# EAGLE schematic Thermal Cycler Calibration Plate v1 (EAGLE 7.5.0)
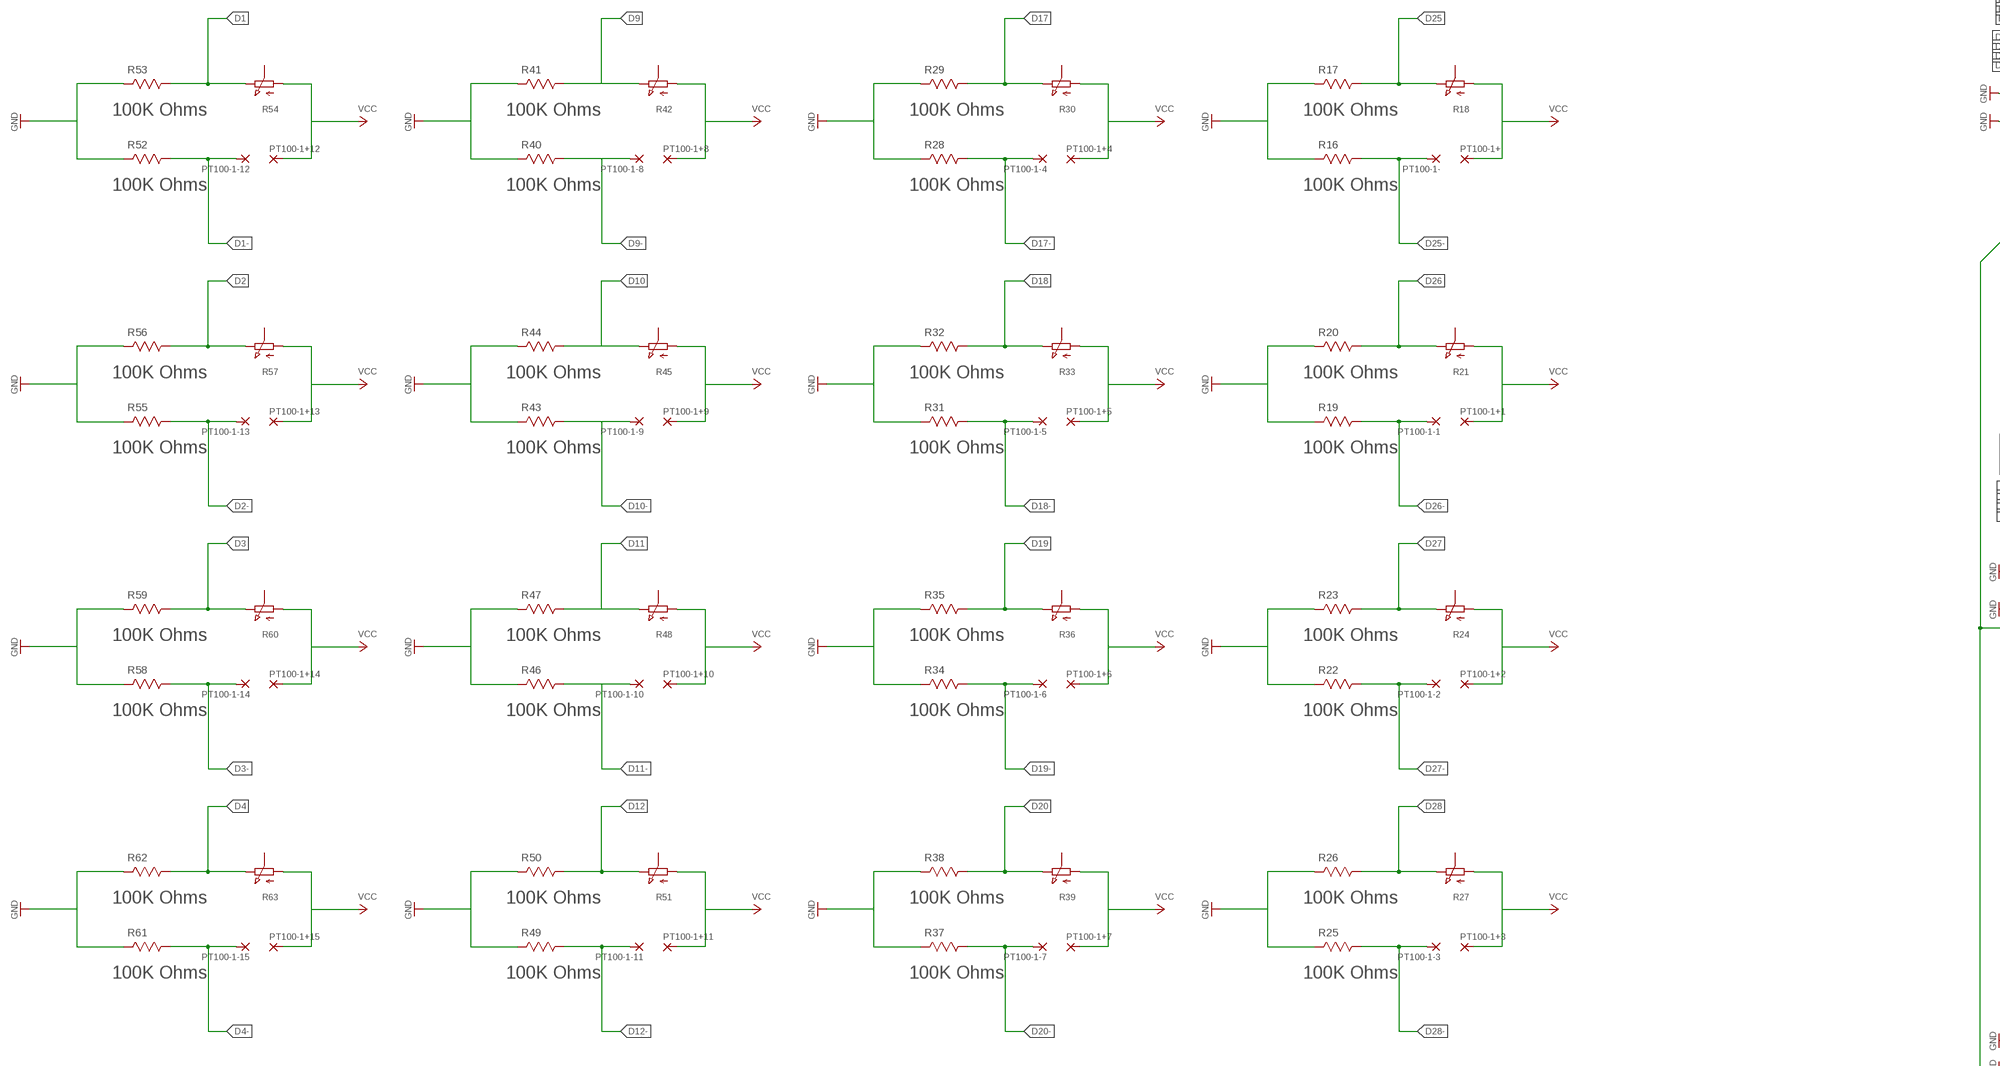
[diagram p0: schematic, sheet 1, part 1 of 3]
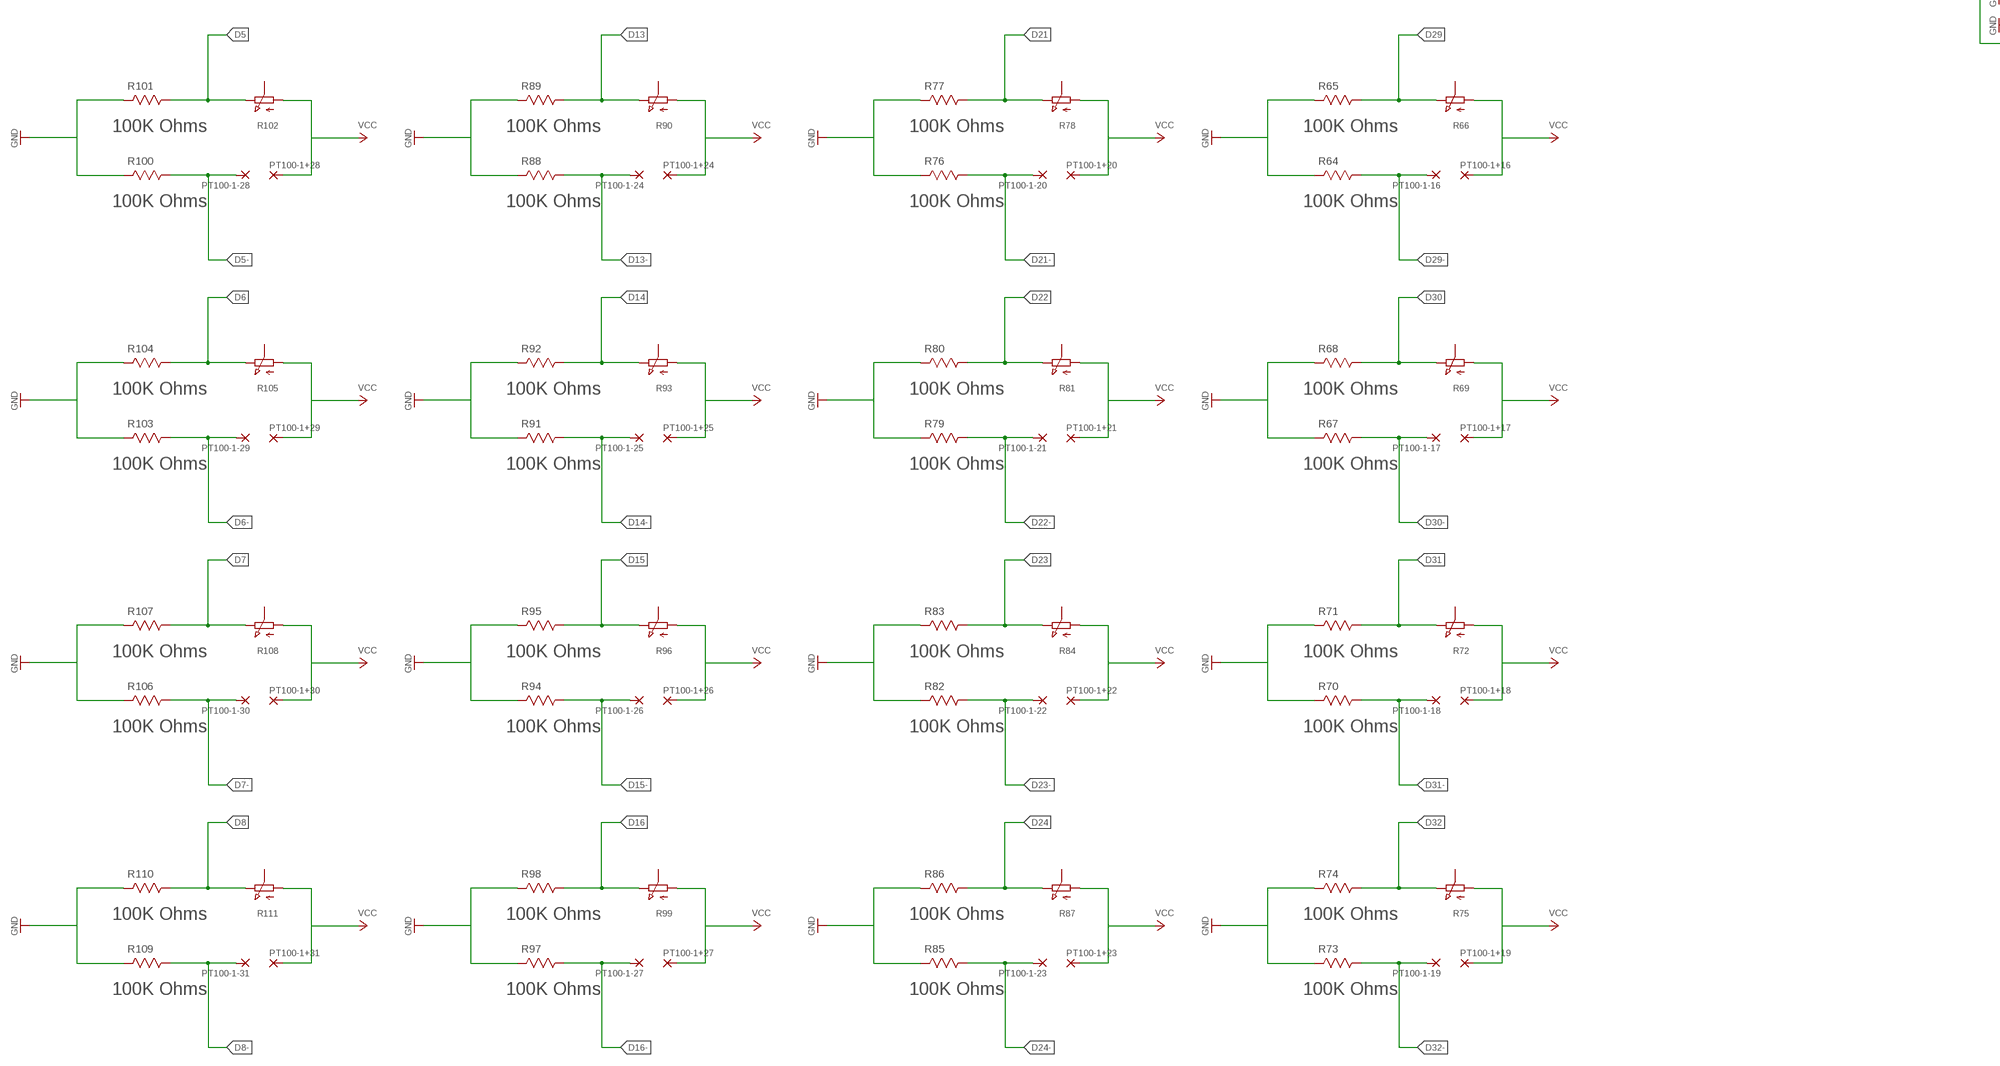
[diagram p1: schematic, sheet 1, part 2 of 3]
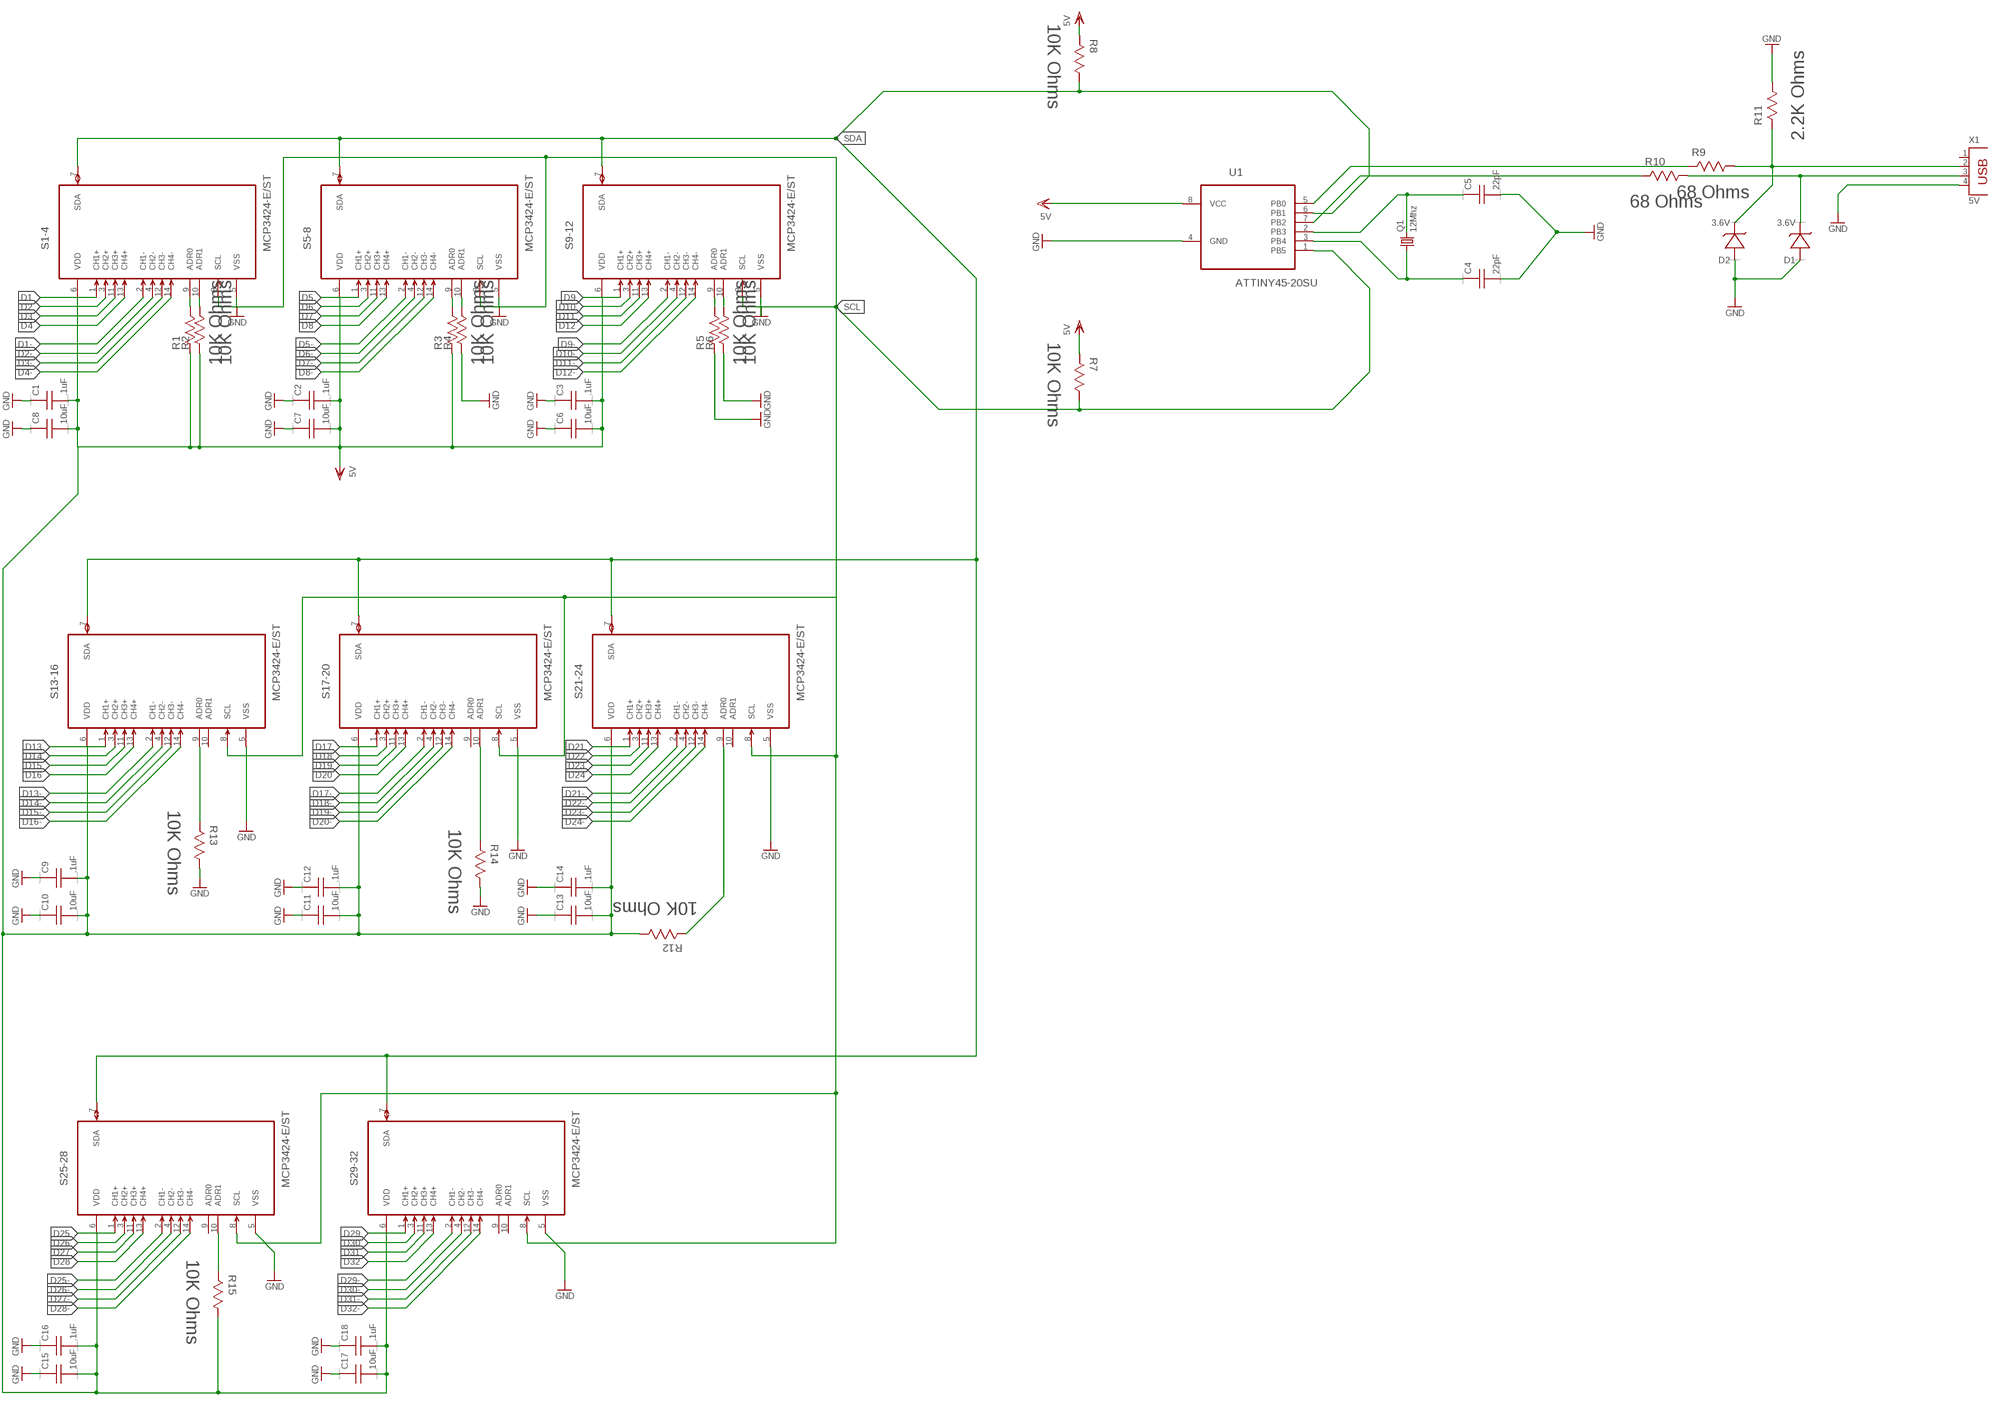
[diagram p2: schematic, sheet 1, part 3 of 3]

## Parts
C1  .1uF  CAP  [C0805]
C2  .1uF  CAP  [C0805]
C3  .1uF  CAP  [C0805]
C4  22pF  CAP  [C0805]
C5  22pF  CAP  [C0805]
C6  10uF  CAP  [C0805]
C7  10uF  CAP  [C0805]
C8  10uF  CAP  [C0805]
C9  .1uF  CAP  [C0805]
C10  10uF  CAP  [C0805]
C11  10uF  CAP  [C0805]
C12  .1uF  CAP  [C0805]
C13  10uF  CAP  [C0805]
C14  .1uF  CAP  [C0805]
C15  10uF  CAP  [C0805]
C16  .1uF  CAP  [C0805]
C17  10uF  CAP  [C0805]
C18  .1uF  CAP  [C0805]
D1  3.6V  ZENER  [SOD123]
D2  3.6V  ZENER  [SOD123]
PT100-1+  1,6/0,8  [1,6/0,8]
PT100-1+1  1,6/0,8  [1,6/0,8]
PT100-1+2  1,6/0,8  [1,6/0,8]
PT100-1+3  1,6/0,8  [1,6/0,8]
PT100-1+4  1,6/0,8  [1,6/0,8]
PT100-1+5  1,6/0,8  [1,6/0,8]
PT100-1+6  1,6/0,8  [1,6/0,8]
PT100-1+7  1,6/0,8  [1,6/0,8]
PT100-1+8  1,6/0,8  [1,6/0,8]
PT100-1+9  1,6/0,8  [1,6/0,8]
PT100-1+10  1,6/0,8  [1,6/0,8]
PT100-1+11  1,6/0,8  [1,6/0,8]
PT100-1+12  1,6/0,8  [1,6/0,8]
PT100-1+13  1,6/0,8  [1,6/0,8]
PT100-1+14  1,6/0,8  [1,6/0,8]
PT100-1+15  1,6/0,8  [1,6/0,8]
PT100-1+16  1,6/0,8  [1,6/0,8]
PT100-1+17  1,6/0,8  [1,6/0,8]
PT100-1+18  1,6/0,8  [1,6/0,8]
PT100-1+19  1,6/0,8  [1,6/0,8]
PT100-1+20  1,6/0,8  [1,6/0,8]
PT100-1+21  1,6/0,8  [1,6/0,8]
PT100-1+22  1,6/0,8  [1,6/0,8]
PT100-1+23  1,6/0,8  [1,6/0,8]
PT100-1+24  1,6/0,8  [1,6/0,8]
PT100-1+25  1,6/0,8  [1,6/0,8]
PT100-1+26  1,6/0,8  [1,6/0,8]
PT100-1+27  1,6/0,8  [1,6/0,8]
PT100-1+28  1,6/0,8  [1,6/0,8]
PT100-1+29  1,6/0,8  [1,6/0,8]
PT100-1+30  1,6/0,8  [1,6/0,8]
PT100-1+31  1,6/0,8  [1,6/0,8]
PT100-1-  1,6/0,8  [1,6/0,8]
PT100-1-1  1,6/0,8  [1,6/0,8]
PT100-1-2  1,6/0,8  [1,6/0,8]
PT100-1-3  1,6/0,8  [1,6/0,8]
PT100-1-4  1,6/0,8  [1,6/0,8]
PT100-1-5  1,6/0,8  [1,6/0,8]
PT100-1-6  1,6/0,8  [1,6/0,8]
PT100-1-7  1,6/0,8  [1,6/0,8]
PT100-1-8  1,6/0,8  [1,6/0,8]
PT100-1-9  1,6/0,8  [1,6/0,8]
PT100-1-10  1,6/0,8  [1,6/0,8]
PT100-1-11  1,6/0,8  [1,6/0,8]
PT100-1-12  1,6/0,8  [1,6/0,8]
PT100-1-13  1,6/0,8  [1,6/0,8]
PT100-1-14  1,6/0,8  [1,6/0,8]
PT100-1-15  1,6/0,8  [1,6/0,8]
PT100-1-16  1,6/0,8  [1,6/0,8]
PT100-1-17  1,6/0,8  [1,6/0,8]
PT100-1-18  1,6/0,8  [1,6/0,8]
PT100-1-19  1,6/0,8  [1,6/0,8]
PT100-1-20  1,6/0,8  [1,6/0,8]
PT100-1-21  1,6/0,8  [1,6/0,8]
PT100-1-22  1,6/0,8  [1,6/0,8]
PT100-1-23  1,6/0,8  [1,6/0,8]
PT100-1-24  1,6/0,8  [1,6/0,8]
PT100-1-25  1,6/0,8  [1,6/0,8]
PT100-1-26  1,6/0,8  [1,6/0,8]
PT100-1-27  1,6/0,8  [1,6/0,8]
PT100-1-28  1,6/0,8  [1,6/0,8]
PT100-1-29  1,6/0,8  [1,6/0,8]
PT100-1-30  1,6/0,8  [1,6/0,8]
PT100-1-31  1,6/0,8  [1,6/0,8]
Q1  12Mhz  CRYSTALHC49UP  [HC49UP]
R1  10K Ohms  P0805Z1002WNT0079  [RESC2013X65N]
R2  10K Ohms  P0805Z1002WNT0079  [RESC2013X65N]
R3  10K Ohms  P0805Z1002WNT0079  [RESC2013X65N]
R4  10K Ohms  P0805Z1002WNT0079  [RESC2013X65N]
R5  10K Ohms  P0805Z1002WNT0079  [RESC2013X65N]
R6  10K Ohms  P0805Z1002WNT0079  [RESC2013X65N]
R7  10K Ohms  P0805Z1002WNT0079  [RESC2013X65N]
R8  10K Ohms  P0805Z1002WNT0079  [RESC2013X65N]
R9  68 Ohms  P0805Z1002WNT0079  [RESC2013X65N]
R10  68 Ohms  P0805Z1002WNT0079  [RESC2013X65N]
R11  2.2K Ohms  P0805Z1002WNT0079  [RESC2013X65N]
R12  10K Ohms  P0805Z1002WNT0079  [RESC2013X65N]
R13  10K Ohms  P0805Z1002WNT0079  [RESC2013X65N]
R14  10K Ohms  P0805Z1002WNT0079  [RESC2013X65N]
R15  10K Ohms  P0805Z1002WNT0079  [RESC2013X65N]
R16  100K Ohms  TNPW0805100KBEEN  [RESC2013X65N]
R17  100K Ohms  TNPW0805100KBEEN  [RESC2013X65N]
R18  PC25  [PC25]
R19  100K Ohms  TNPW0805100KBEEN  [RESC2013X65N]
R20  100K Ohms  TNPW0805100KBEEN  [RESC2013X65N]
R21  PC25  [PC25]
R22  100K Ohms  TNPW0805100KBEEN  [RESC2013X65N]
R23  100K Ohms  TNPW0805100KBEEN  [RESC2013X65N]
R24  PC25  [PC25]
R25  100K Ohms  TNPW0805100KBEEN  [RESC2013X65N]
R26  100K Ohms  TNPW0805100KBEEN  [RESC2013X65N]
R27  PC25  [PC25]
R28  100K Ohms  TNPW0805100KBEEN  [RESC2013X65N]
R29  100K Ohms  TNPW0805100KBEEN  [RESC2013X65N]
R30  PC25  [PC25]
R31  100K Ohms  TNPW0805100KBEEN  [RESC2013X65N]
R32  100K Ohms  TNPW0805100KBEEN  [RESC2013X65N]
R33  PC25  [PC25]
R34  100K Ohms  TNPW0805100KBEEN  [RESC2013X65N]
R35  100K Ohms  TNPW0805100KBEEN  [RESC2013X65N]
R36  PC25  [PC25]
R37  100K Ohms  TNPW0805100KBEEN  [RESC2013X65N]
R38  100K Ohms  TNPW0805100KBEEN  [RESC2013X65N]
R39  PC25  [PC25]
R40  100K Ohms  TNPW0805100KBEEN  [RESC2013X65N]
R41  100K Ohms  TNPW0805100KBEEN  [RESC2013X65N]
R42  PC25  [PC25]
R43  100K Ohms  TNPW0805100KBEEN  [RESC2013X65N]
R44  100K Ohms  TNPW0805100KBEEN  [RESC2013X65N]
R45  PC25  [PC25]
R46  100K Ohms  TNPW0805100KBEEN  [RESC2013X65N]
R47  100K Ohms  TNPW0805100KBEEN  [RESC2013X65N]
R48  PC25  [PC25]
R49  100K Ohms  TNPW0805100KBEEN  [RESC2013X65N]
R50  100K Ohms  TNPW0805100KBEEN  [RESC2013X65N]
R51  PC25  [PC25]
R52  100K Ohms  TNPW0805100KBEEN  [RESC2013X65N]
R53  100K Ohms  TNPW0805100KBEEN  [RESC2013X65N]
R54  PC25  [PC25]
R55  100K Ohms  TNPW0805100KBEEN  [RESC2013X65N]
R56  100K Ohms  TNPW0805100KBEEN  [RESC2013X65N]
R57  PC25  [PC25]
R58  100K Ohms  TNPW0805100KBEEN  [RESC2013X65N]
R59  100K Ohms  TNPW0805100KBEEN  [RESC2013X65N]
R60  PC25  [PC25]
R61  100K Ohms  TNPW0805100KBEEN  [RESC2013X65N]
R62  100K Ohms  TNPW0805100KBEEN  [RESC2013X65N]
R63  PC25  [PC25]
R64  100K Ohms  TNPW0805100KBEEN  [RESC2013X65N]
R65  100K Ohms  TNPW0805100KBEEN  [RESC2013X65N]
R66  PC25  [PC25]
R67  100K Ohms  TNPW0805100KBEEN  [RESC2013X65N]
R68  100K Ohms  TNPW0805100KBEEN  [RESC2013X65N]
R69  PC25  [PC25]
R70  100K Ohms  TNPW0805100KBEEN  [RESC2013X65N]
R71  100K Ohms  TNPW0805100KBEEN  [RESC2013X65N]
R72  PC25  [PC25]
R73  100K Ohms  TNPW0805100KBEEN  [RESC2013X65N]
R74  100K Ohms  TNPW0805100KBEEN  [RESC2013X65N]
R75  PC25  [PC25]
R76  100K Ohms  TNPW0805100KBEEN  [RESC2013X65N]
R77  100K Ohms  TNPW0805100KBEEN  [RESC2013X65N]
R78  PC25  [PC25]
R79  100K Ohms  TNPW0805100KBEEN  [RESC2013X65N]
R80  100K Ohms  TNPW0805100KBEEN  [RESC2013X65N]
R81  PC25  [PC25]
R82  100K Ohms  TNPW0805100KBEEN  [RESC2013X65N]
R83  100K Ohms  TNPW0805100KBEEN  [RESC2013X65N]
R84  PC25  [PC25]
R85  100K Ohms  TNPW0805100KBEEN  [RESC2013X65N]
R86  100K Ohms  TNPW0805100KBEEN  [RESC2013X65N]
R87  PC25  [PC25]
R88  100K Ohms  TNPW0805100KBEEN  [RESC2013X65N]
R89  100K Ohms  TNPW0805100KBEEN  [RESC2013X65N]
R90  PC25  [PC25]
R91  100K Ohms  TNPW0805100KBEEN  [RESC2013X65N]
R92  100K Ohms  TNPW0805100KBEEN  [RESC2013X65N]
R93  PC25  [PC25]
R94  100K Ohms  TNPW0805100KBEEN  [RESC2013X65N]
R95  100K Ohms  TNPW0805100KBEEN  [RESC2013X65N]
R96  PC25  [PC25]
R97  100K Ohms  TNPW0805100KBEEN  [RESC2013X65N]
R98  100K Ohms  TNPW0805100KBEEN  [RESC2013X65N]
R99  PC25  [PC25]
R100  100K Ohms  TNPW0805100KBEEN  [RESC2013X65N]
R101  100K Ohms  TNPW0805100KBEEN  [RESC2013X65N]
R102  PC25  [PC25]
R103  100K Ohms  TNPW0805100KBEEN  [RESC2013X65N]
R104  100K Ohms  TNPW0805100KBEEN  [RESC2013X65N]
R105  PC25  [PC25]
R106  100K Ohms  TNPW0805100KBEEN  [RESC2013X65N]
R107  100K Ohms  TNPW0805100KBEEN  [RESC2013X65N]
R108  PC25  [PC25]
R109  100K Ohms  TNPW0805100KBEEN  [RESC2013X65N]
R110  100K Ohms  TNPW0805100KBEEN  [RESC2013X65N]
R111  PC25  [PC25]
S1-4  MCP3424-E/ST  [SOP65P640X120-14N]
S5-8  MCP3424-E/ST  [SOP65P640X120-14N]
S9-12  MCP3424-E/ST  [SOP65P640X120-14N]
S13-16  MCP3424-E/ST  [SOP65P640X120-14N]
S17-20  MCP3424-E/ST  [SOP65P640X120-14N]
S21-24  MCP3424-E/ST  [SOP65P640X120-14N]
S25-28  MCP3424-E/ST  [SOP65P640X120-14N]
S29-32  MCP3424-E/ST  [SOP65P640X120-14N]
U1  ATTINY45-20SU  [SOIC127P798X216-8N]
X1  5V  PN87520  [PN87520]

## Nets
D1: R53.1 R54.E S1-4.1(CH1+)
D1-: PT100-1-12.1(P) R52.1 S1-4.2(CH1-)
D2: R56.1 R57.E S1-4.3(CH2+)
D2-: PT100-1-13.1(P) R55.1 S1-4.4(CH2-)
D3: R59.1 R60.E S1-4.11(CH3+)
D3-: PT100-1-14.1(P) R58.1 S1-4.12(CH3-)
D4: R62.1 R63.E S1-4.13(CH4+)
D4-: PT100-1-15.1(P) R61.1 S1-4.14(CH4-)
D5: R101.1 R102.E S5-8.1(CH1+)
D5-: PT100-1-28.1(P) R100.1 S5-8.2(CH1-)
D6: R104.1 R105.E S5-8.3(CH2+)
D6-: PT100-1-29.1(P) R103.1 S5-8.4(CH2-)
D7: R107.1 R108.E S5-8.11(CH3+)
D7-: PT100-1-30.1(P) R106.1 S5-8.12(CH3-)
D8: R110.1 R111.E S5-8.13(CH4+)
D8-: PT100-1-31.1(P) R109.1 S5-8.14(CH4-)
D9: R41.1 R42.E S9-12.1(CH1+)
D9-: PT100-1-8.1(P) R40.1 S9-12.2(CH1-)
D10: R44.1 R45.E S9-12.3(CH2+)
D10-: PT100-1-9.1(P) R43.1 S9-12.4(CH2-)
D11: R47.1 R48.E S9-12.11(CH3+)
D11-: PT100-1-10.1(P) R46.1 S9-12.12(CH3-)
D12: R50.1 R51.E S9-12.13(CH4+)
D12-: PT100-1-11.1(P) R49.1 S9-12.14(CH4-)
D13: R89.1 R90.E S13-16.1(CH1+)
D13-: PT100-1-24.1(P) R88.1 S13-16.2(CH1-)
D14: R92.1 R93.E S13-16.3(CH2+)
D14-: PT100-1-25.1(P) R91.1 S13-16.4(CH2-)
D15: R95.1 R96.E S13-16.11(CH3+)
D15-: PT100-1-26.1(P) R94.1 S13-16.12(CH3-)
D16: R98.1 R99.E S13-16.13(CH4+)
D16-: PT100-1-27.1(P) R97.1 S13-16.14(CH4-)
D17: R29.1 R30.E S17-20.1(CH1+)
D17-: PT100-1-4.1(P) R28.1 S17-20.2(CH1-)
D18: R32.1 R33.E S17-20.3(CH2+)
D18-: PT100-1-5.1(P) R31.1 S17-20.4(CH2-)
D19: R35.1 R36.E S17-20.11(CH3+)
D19-: PT100-1-6.1(P) R34.1 S17-20.12(CH3-)
D20: R38.1 R39.E S17-20.13(CH4+)
D20-: PT100-1-7.1(P) R37.1 S17-20.14(CH4-)
D21: R77.1 R78.E S21-24.1(CH1+)
D21-: PT100-1-20.1(P) R76.1 S21-24.2(CH1-)
D22: R80.1 R81.E S21-24.3(CH2+)
D22-: PT100-1-21.1(P) R79.1 S21-24.4(CH2-)
D23: R83.1 R84.E S21-24.11(CH3+)
D23-: PT100-1-22.1(P) R82.1 S21-24.12(CH3-)
D24: R86.1 R87.E S21-24.13(CH4+)
D24-: PT100-1-23.1(P) R85.1 S21-24.14(CH4-)
D25: R17.1 R18.E S25-28.1(CH1+)
D25-: PT100-1-.1(P) R16.1 S25-28.2(CH1-)
D26: R20.1 R21.E S25-28.3(CH2+)
D26-: PT100-1-1.1(P) R19.1 S25-28.4(CH2-)
D27: R23.1 R24.E S25-28.11(CH3+)
D27-: PT100-1-2.1(P) R22.1 S25-28.12(CH3-)
D28: R26.1 R27.E S25-28.13(CH4+)
D28-: PT100-1-3.1(P) R25.1 S25-28.14(CH4-)
D29: R65.1 R66.E S29-32.1(CH1+)
D29-: PT100-1-16.1(P) R64.1 S29-32.2(CH1-)
D30: R68.1 R69.E S29-32.3(CH2+)
D30-: PT100-1-17.1(P) R67.1 S29-32.4(CH2-)
D31: R71.1 R72.E S29-32.11(CH3+)
D31-: PT100-1-18.1(P) R70.1 S29-32.12(CH3-)
D32: R74.1 R75.E S29-32.13(CH4+)
D32-: PT100-1-19.1(P) R73.1 S29-32.14(CH4-)
GND: C1.1(A) C2.1(A) C3.1(A) C4.2(B) C5.2(B) C6.1(A) C7.1(A) C8.1(A) C9.1(A) C10.1(A) C11.1(A) C12.1(A) C13.1(A) C14.1(A) C15.1(A) C16.1(A) C17.1(A) C18.1(A) D1.A(+) D2.A(+) R4.2 R5.2 R6.2 R11.1 R13.1 R14.1 R16.2 R17.2 R19.2 R20.2 R22.2 R23.2 R25.2 R26.2 R28.2 R29.2 R31.2 R32.2 R34.2 R35.2 R37.2 R38.2 R40.2 R41.2 R43.2 R44.2 R46.2 R47.2 R49.2 R50.2 R52.2 R53.2 R55.2 R56.2 R58.2 R59.2 R61.2 R62.2 R64.2 R65.2 R67.2 R68.2 R70.2 R71.2 R73.2 R74.2 R76.2 R77.2 R79.2 R80.2 R82.2 R83.2 R85.2 R86.2 R88.2 R89.2 R91.2 R92.2 R94.2 R95.2 R97.2 R98.2 R100.2 R101.2 R103.2 R104.2 R106.2 R107.2 R109.2 R110.2 S1-4.5(VSS) S5-8.5(VSS) S13-16.5(VSS) S17-20.5(VSS) S21-24.5(VSS) S25-28.5(VSS) S29-32.5(VSS) U1.4(GND) X1.4
N$1: R13.2 S13-16.9(ADR0)
N$2: S9-12.5(VSS)
N$3: R1.1 S1-4.9(ADR0)
N$4: R2.1 S1-4.10(ADR1)
N$5: R3.1 S5-8.9(ADR0)
N$6: R4.1 S5-8.10(ADR1)
N$7: R14.2 S17-20.10(ADR1)
N$8: R5.1 S9-12.9(ADR0)
N$9: R6.1 S9-12.10(ADR1)
N$11: R15.2 S25-28.10(ADR1)
N$13: R12.2 S21-24.9(ADR0)
N$33: R9.2 U1.5(PB0)
N$34: R10.2 U1.7(PB2)
N$35: D2.C(-) R9.1 R11.2 X1.2
N$36: D1.C(-) R10.1 X1.3
N$38: C4.1(A) Q1.1 U1.3(PB4)
N$39: C5.1(A) Q1.2 U1.2(PB3)
SCL: R7.1 S1-4.8(SCL) S5-8.8(SCL) S9-12.8(SCL) S13-16.8(SCL) S17-20.8(SCL) S21-24.8(SCL) S25-28.8(SCL) S29-32.8(SCL) U1.1(PB5)
SDA: R8.1 S1-4.7(SDA) S5-8.7(SDA) S9-12.7(SDA) S13-16.7(SDA) S17-20.7(SDA) S21-24.7(SDA) S25-28.7(SDA) S29-32.7(SDA) U1.6(PB1)
VCC: PT100-1+1.1(P) PT100-1+2.1(P) PT100-1+3.1(P) PT100-1+4.1(P) PT100-1+5.1(P) PT100-1+6.1(P) PT100-1+7.1(P) PT100-1+8.1(P) PT100-1+9.1(P) PT100-1+10.1(P) PT100-1+11.1(P) PT100-1+12.1(P) PT100-1+13.1(P) PT100-1+14.1(P) PT100-1+15.1(P) PT100-1+16.1(P) PT100-1+17.1(P) PT100-1+18.1(P) PT100-1+19.1(P) PT100-1+20.1(P) PT100-1+21.1(P) PT100-1+22.1(P) PT100-1+23.1(P) PT100-1+24.1(P) PT100-1+25.1(P) PT100-1+26.1(P) PT100-1+27.1(P) PT100-1+28.1(P) PT100-1+29.1(P) PT100-1+30.1(P) PT100-1+31.1(P) PT100-1+.1(P) R18.A R21.A R24.A R27.A R30.A R33.A R36.A R39.A R42.A R45.A R48.A R51.A R54.A R57.A R60.A R63.A R66.A R69.A R72.A R75.A R78.A R81.A R84.A R87.A R90.A R93.A R96.A R99.A R102.A R105.A R108.A R111.A
VDD: C1.2(B) C2.2(B) C3.2(B) C6.2(B) C7.2(B) C8.2(B) C9.2(B) C10.2(B) C11.2(B) C12.2(B) C13.2(B) C14.2(B) C15.2(B) C16.2(B) C17.2(B) C18.2(B) R1.2 R2.2 R3.2 R7.2 R8.2 R12.1 R15.1 S1-4.6(VDD) S5-8.6(VDD) S9-12.6(VDD) S13-16.6(VDD) S17-20.6(VDD) S21-24.6(VDD) S25-28.6(VDD) S29-32.6(VDD) U1.8(VCC) ; supply symbol labelled 5V
Unconnected: R18.S R21.S R24.S R27.S R30.S R33.S R36.S R39.S R42.S R45.S R48.S R51.S R54.S R57.S R60.S R63.S R66.S R69.S R72.S R75.S R78.S R81.S R84.S R87.S R90.S R93.S R96.S R99.S R102.S R105.S R108.S R111.S S13-16.10(ADR1) S17-20.9(ADR0) S21-24.10(ADR1) S25-28.9(ADR0) S29-32.9(ADR0) S29-32.10(ADR1) X1.1

## Library data of the parts
C1-C18 = sym:CAP: Capacitor
D1 D2 = sym:ZENER: Zener Diode
PT100-1+ PT100-1+1-PT100-1+31 PT100-1- PT100-1-1-PT100-1-31 = wirepad:1,6/0,8: THROUGH-HOLE PAD
Q1 = crystal:CRYSTAL: CRYSTAL; OC_FARNELL: unknown; OC_NEWARK: unknown
R1-R8 R12-R15 = Vishay_By_element14_Batch_1:P0805Z1002WNT0079: RESISTOR, 0805; MPN: P0805Z1002WNT0079; OC_FARNELL: 1791003; OC_NEWARK: 70R0101; SUPPLIER: Vishay; TOLERANCE: ± 0.05 %; WATTAGE: 200mW
R9-R11 = Vishay_By_element14_Batch_1:P0805Z1002WNT0079: RESISTOR, 0805; MPN: P0805Z1002WNT0079; OC_FARNELL: 1791003; OC_NEWARK: 70R0101; SUPPLIER: Vishay; TOLERANCE: ± 0.05 %; VALUE: 10K Ohms; WATTAGE: 200mW
R16 R17 R19 R20 R22 R23 R25 R26 R28 R29 R31 R32 R34 R35 R37 R38 R40 R41 R43 R44 R46 R47 R49 R50 R52 R53 R55 R56 R58 R59 R61 R62 R64 R65 R67 R68 R70 R71 R73 R74 R76 R77 R79 R80 R82 R83 R85 R86 R88 R89 R91 R92 R94 R95 R97 R98 R100 R101 R103 R104 R106 R107 R109 R110 = Vishay_By_element14_Batch_1:TNPW0805100KBEEN: RESISTOR, 0805; MPN: TNPW0805100KBEEN; OC_FARNELL: 1871315; OC_NEWARK: 16M0342; SUPPLIER: Vishay Dale; TOLERANCE: ±0.1%; WATTAGE: 0.125 W
R18 R21 R24 R27 R30 R33 R36 R39 R42 R45 R48 R51 R54 R57 R60 R63 R66 R69 R72 R75 R78 R81 R84 R87 R90 R93 R96 R99 R102 R105 R108 R111 = pot-vitrohm:PC25: VITROHM POTENTIOMETER; MF: CLAROSTAT; MPN: 308NPC25KS; OC_FARNELL: 1440998; OC_NEWARK: 03F7518
S1-4 S5-8 S9-12 S13-16 S17-20 S21-24 S25-28 S29-32 = Microchip_By_element14_Batch_1:MCP3424-E/ST: Analog-to-Digital Converter; MPN: MCP3424-E/ST; OC_FARNELL: 1630423; OC_NEWARK: 54M4872; PACKAGE: SOP-14; SUPPLIER: Microchip
U1 = Atmel_By_element14_Batch_1-00:ATTINY45-20SU: 8-bit Microcontroller with 4 Bytes In-System Programmable Flash; MPN: ATTINY45-20SU; OC_FARNELL: 1288353; OC_NEWARK: 23M5073; PACKAGE: SOIC-8; SUPPLIER: Atmel
X1 = con-berg:PN87520: BERG USB connector; OC_FARNELL: unknown; OC_NEWARK: unknown